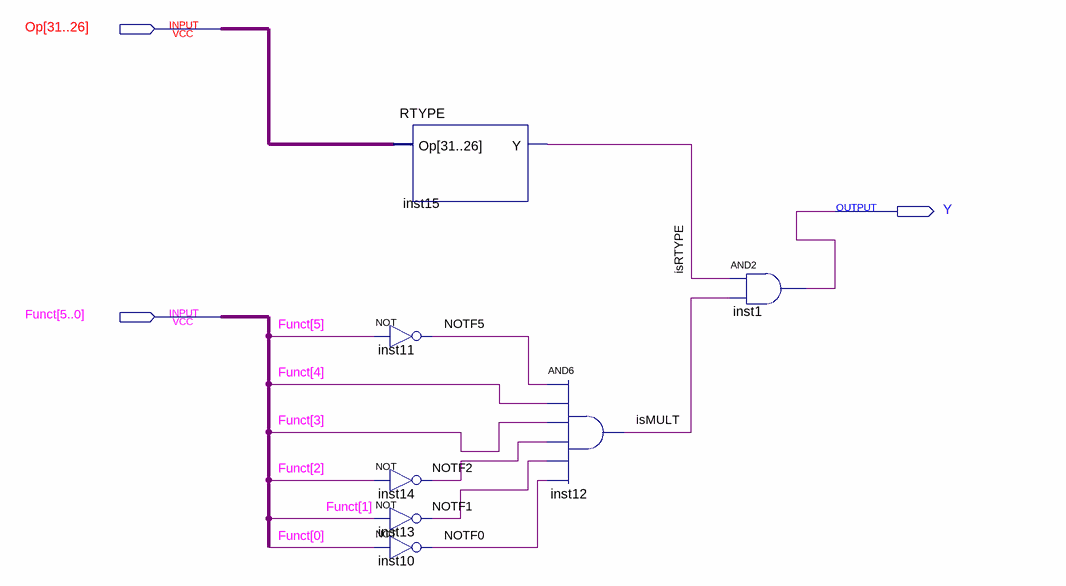
[diagram p0: schematic sheet]
// Quartus schematic MULT.bdf as structural Verilog: 7 symbols, 3 pins
module MULT (
  input  [31:26] Op,
  input  [5:0] Funct,
  output Y
);

  wire isMULT, isRTYPE, NOTF0, NOTF1, NOTF2, NOTF5;

  RTYPE inst15 (.Op(Op), .Y(isRTYPE));
  not inst11 (NOTF5, Funct[5]);
  not inst14 (NOTF2, Funct[2]);
  not inst13 (NOTF1, Funct[1]);
  not inst10 (NOTF0, Funct[0]);
  and inst12 (isMULT, NOTF5, Funct[4], Funct[3], NOTF2, NOTF1, NOTF0);
  and inst1 (Y, isRTYPE, isMULT);
endmodule
